# EAGLE design femtoBeacon_dongle_r2.0.3 (EAGLE 7.6.0)
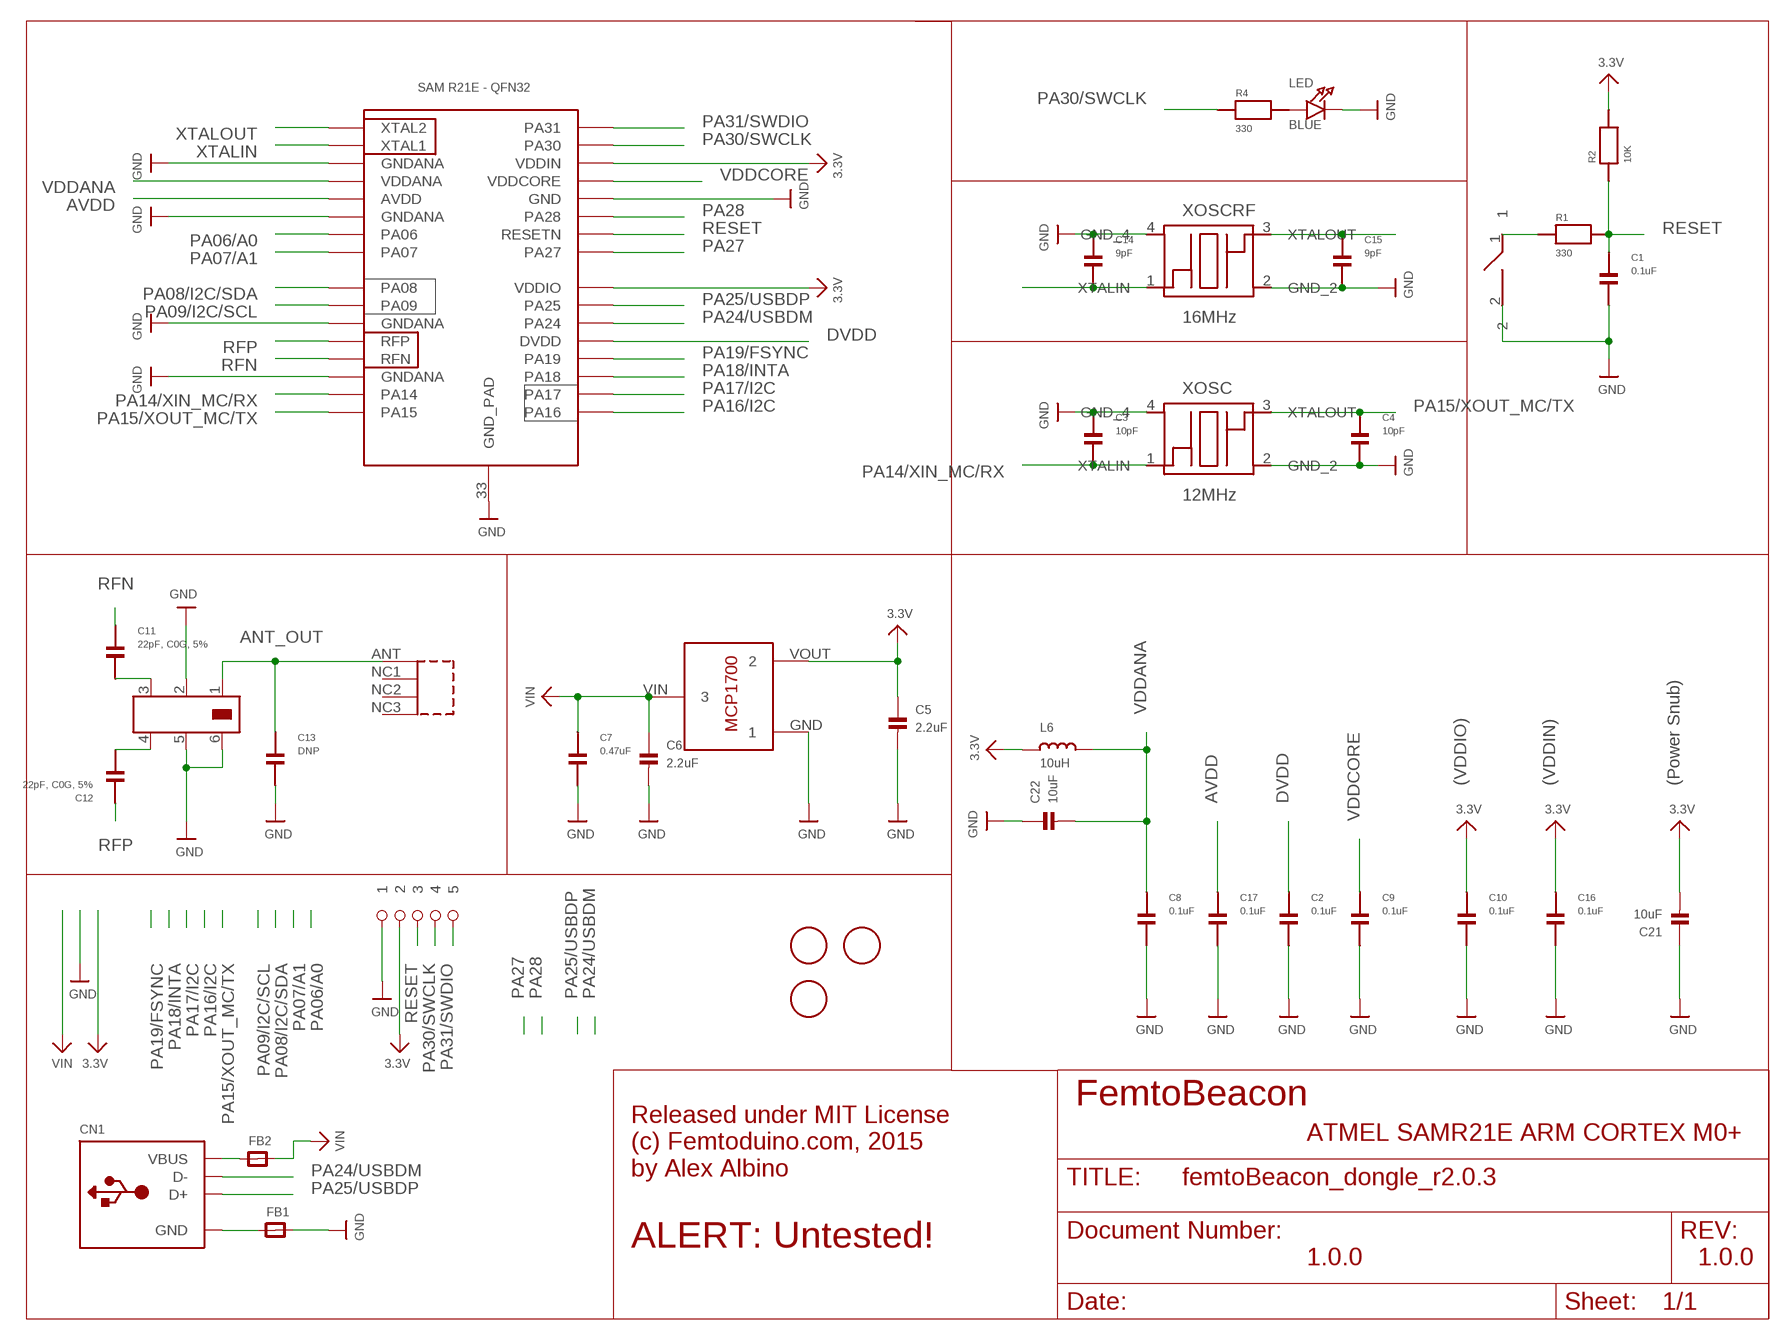
[diagram p0: schematic, sheet 1]

## Parts
BTN  DNP  SPST_SMD  [SPST_SMD]
C1  0.1uF  CAPACITOR_0201  [PART]
C2  0.1uF  CAPACITOR_0201  [PART]
C3  10pF  CAPACITOR_0201  [PART]
C4  10pF  CAPACITOR_0201  [PART]
C5  2.2uF  CAP_CERAMIC_0402MP  [_0402MP]
C6  2.2uF  CAP_CERAMIC_0402MP  [_0402MP]
C7  0.47uF  CAPACITOR_0201  [PART]
C8  0.1uF  CAPACITOR_0201  [PART]
C9  0.1uF  CAPACITOR_0201  [PART]
C10  0.1uF  CAPACITOR_0201  [PART]
C11  22pF, C0G, 5%  CAPACITOR_0201  [PART]
C12  22pF, C0G, 5%  CAPACITOR_0201  [PART]
C13  DNP  CAPACITOR_0201  [PART]
C14  9pF  CAPACITOR_0201  [PART]
C15  9pF  CAPACITOR_0201  [PART]
C16  0.1uF  CAPACITOR_0201  [PART]
C17  0.1uF  CAPACITOR_0201  [PART]
C21  10uF  CAP_CERAMIC_0402MP  [_0402MP]
C22  10uF  CAP_CERAMIC_0402MP  [_0402MP]
CN1  USB_TYPEA  [USB_A-SMT]
FB1  FERRITE_0603MP  [_0603MP]
FB2  FERRITE_0603MP  [_0603MP]
FID1  FIDUCIAL  [FIDUCIAL_1MM]
FID2  FIDUCIAL  [FIDUCIAL_1MM]
FID3  FIDUCIAL  [FIDUCIAL_1MM]
L6  10uH  INDUCTOR_0603MP  [_0603MP]
LDO_VREG  MCP1700T-3302E/TT  [MCP1700T-3302E/TT]
LED  BLUE  LED0603_NOOUTLINE  [CHIPLED_0603_NOOUTLINE]
R1  330  RESISTOR_0201  [PART]
R2  10K  RESISTOR_0201  [PART]
R4  330  RESISTOR_0201  [PART]
U$1  1X5_ROUND  [1X5_ROUND]
U$6  0479480001  [0479480001]
U$12  JOHANSON_2450BM15A0015E  [0805_BALUN]
U$76  ATSAMR21E18A-MUT  [QFN32]
XOSC  12MHz  TSX-3225  [TSX-3225]
XOSCRF  16MHz  TSX-3225  [TSX-3225]

## Nets
3.3V: C5.1 C10.1 C16.1 C21.2 L6.1 LDO_VREG.VOUT R2.2 U$1.P$2 U$76.24(VDDIO) U$76.30(VDDIN)
ANT_OUT: C13.1 U$6.ANT U$12.1
AVDD: C17.1 U$76.5(AVDD)
DVDD: C2.1 U$76.21(DVDD)
GND: BTN.2 C1.2 C2.2 C3.1 C4.2 C5.2 C6.2 C7.2 C8.2 C9.2 C10.2 C13.2 C14.1 C15.2 C16.2 C17.2 C21.1 C22.1 FB1.2 LDO_VREG.GND LED.C U$1.P$1 U$12.2 U$12.5 U$12.6 U$76.3(GNDANA) U$76.6(GNDANA) U$76.11(GNDANA) U$76.14(GNDANA) U$76.28(GND) U$76.33(GND_PAD) XOSC.2(GND_2) XOSC.4(GND_4) XOSCRF.2(GND_2) XOSCRF.4(GND_4)
N$1: C11.2 U$12.3
N$3: C12.2 U$12.4
N$4: CN1.VBUS FB2.1
N$5: CN1.GND FB1.1
N$13: LED.A R4.2
N$26: BTN.1 R1.1
PA06/A0: U$76.7(PA06)
PA07/A1: U$76.8(PA07)
PA08/I2C/SDA: U$76.9(PA08)
PA09/I2C/SCL: U$76.10(PA09)
PA14/XIN_MC/RX: C3.2 U$76.15(PA14) XOSC.1(XTALIN)
PA15/XOUT_MC/TX: C4.1 U$76.16(PA15) XOSC.3(XTALOUT)
PA16/I2C: U$76.17(PA16)
PA17/I2C: U$76.18(PA17)
PA18/INTA: U$76.19(PA18)
PA19/FSYNC: U$76.20(PA19)
PA24/USBDM: CN1.D- U$76.22(PA24)
PA25/USBDP: CN1.D+ U$76.23(PA25)
PA27: U$76.25(PA27)
PA28: U$76.27(PA28)
PA30/SWCLK: R4.1 U$1.P$4 U$76.31(PA30)
PA31/SWDIO: U$1.P$5 U$76.32(PA31)
RESET: C1.1 R1.2 R2.1 U$1.P$3 U$76.26(RESETN)
RFN: C11.1 U$76.13(RFN)
RFP: C12.1 U$76.12(RFP)
VDDANA: C8.1 C22.2 L6.2 U$76.4(VDDANA)
VDDCORE: C9.1 U$76.29(VDDCORE)
VIN: C6.1 C7.1 FB2.2 LDO_VREG.VIN
XTALIN: C14.2 U$76.2(XTAL1) XOSCRF.1(XTALIN)
XTALOUT: C15.1 U$76.1(XTAL2) XOSCRF.3(XTALOUT)
Unconnected: U$6.NC1 U$6.NC2 U$6.NC3

## Notes on the sheet
- (VDDIO) | (VDDIN) | (Power Snub)
- FemtoBeacon
- ATMEL SAMR21E ARM CORTEX M0+
- Released under MIT License
  (c) Femtoduino.com, 2015
  by Alex Albino
- ALERT: Untested!
- 1.0.0 | 1.0.0

## Library data of the parts
BTN = femtoduino:SPST_SMD
C1 C3 C4 C8-C17 = parts_0201:CAPACITOR_0201; DIGIKEY_PART: 490-3194-1-ND
C2 C7 = parts_0201:CAPACITOR_0201
C5 C6 C21 C22 = microbuilder:CAP_CERAMIC: Ceramic Capacitors 0402 - 0402 Surface Mount Capacitors 16pF 50V 5% [Digikey: 445-4899-2-ND] 18pF 50V 5% [Digikey: 490-1281-2-ND] 22pF 50V 5% [Digikey: 490-1283-2-ND] 68pF 50V 5% [Digikey: 490-1289-2-ND] 0.1uF 10V 10% [Digikey: 490-1318-2-ND] 1.0uF 6.3V 10% [Digikey: 490-1320-2-ND] 0603 - 0603 Surface Mount Capacitors 16 pF 50V 5% [Digikey: 445-5051-2-ND] 22 pF 50V [Digikey: PCC220ACVTR-ND] 33 pF 50V 5% [Digikey: 490-1415-1-ND] 56pF 50V 5% [Digikey: 490-1421-1-ND] 220pF 50V 5% [Digikey: 445-1285-1-ND] 680 pF 50V 2200 pF 50V 5% C0G [Digikey: 445-1297-1-ND] 5600 pF 100V 5% X7R [Digikey: 478-3711-1-ND] 0.1 µF 25V 10% [Digikey: PCC2277TR-ND] 0.22 µF 16V 10% X7R [Digikey: 445-1318-1-ND] 1.0 µF 25V 10% [Digikey: 445-5146-2-ND] 0603 - RF Specific 3pF 250V +/-0.1pF RF [Digikey: 712-1347-1-ND] 18 pF 250V 5% [Digikey: 478-3505-1-ND or 712-1322-1-ND] 56 pF 250V 5% C0G RF [Digikey: 490-4867-1-ND] 68 pF 250V RF [Digikey: 490-4868-1-ND] 0805 - 0805 Surface Mount Capacitors 220 pF 250V 2% RF Ceramic Capacitor [Digikey: 712-1398-1-ND] 1000 pF 50V 2% NP0 Ceramic Capacitor [Digikey: 478-3760-1-ND] 0.1 µF 25V 10% Ceramic Capacitor [Digikey: PCC1828TR-ND] 1.0 µF 16V 10% Ceramic Capacitor[Digikey: 490-1691-2-ND] 10.0 µF 10V 10% Ceramic Capacitor[Digikey: 709-1228-1-ND] 10.0 uF 16V 10% Ceramic Capacitor [Digikey: 478-5165-2-ND] 47 uF 6.3V 20% Ceramic Capacitor [Digikey: 587-1779-1-ND or 399-5506-1-ND] 1206 - 1206 Surface Mount Capacitors 47uF 10V 20% Ceramic Capacitor [Digikey: 490-5528-1-ND or 399-5508-1-ND or 445-6010-1-ND] 100uF 6.3V -20%, +80% Y5V Ceramic Capacitor (Digikey: 490-4512-1-ND, Mouser: 81-GRM31CF50J107ZE1L)
CN1 = microbuilder:USB_TYPEA: USB - Type A Connectors Male types stick out and are inserted into a PC or matching females parts (these are the connectors used on USB Memory Sticks, etc.). Female parts are generally used for USB Host and accept a male-type connector. SMT Male - 4UCON: 10017 PTH Female - Digikey: 609-1045-ND, 4UCon: 05241
FB1 FB2 = microbuilder:FERRITE: Ferrite Bead 0603 MMZ1608B121C - 120 Ohm @ 100MHz, 600mA, 0.15 Ohm DC Resistance - Digikey: 445-2164-1-ND BK1608HW121-T - 120 Ohm, 600mA Ferrite Chip - Digikey: 587-1876-2-ND 0805 HZ0805B272R-10 - 2.7K Ohm @ 100MHz, 200mA, 0.8 Ohm DC Resistance - Digikey: 240-2504-1-ND (see also Murata BLM21BD272SN1L) MMZ2012Y152B - 1.5K Ohm @ 100MHz, 500mA, 0.4 Ohm DC Resistance - Digikey: 445-1560-1-ND - Mainly for high frequency (80-400MHz) MMZ2012R102A - 1K Ohm @ 100MHz, 500mA, 0.3 Ohm DC Resistance - Digikey: 445-1555-2-ND - More general purpose (10-200MHz)
FID1-FID3 = adafruit:FIDUCIAL: For use by pick and place machines to calibrate the vision/machine, 1mm By microbuilder.eu
L6 = microbuilder:INDUCTOR: Inductors 0603: 10nH Ceramic Inductor - microwire antenna/RF (Digikey: 712-1434-2-ND) 0805: 560nH Ceramic Inductor - RF (Digikey: 553-1047-1-ND) 270nH Ceramic Inductor - Q = 40@250MHz, +-5%, 1 Ohm DC Resistance (Digikey: 535-10506-2-ND) 1007 (2518 Metric) SMT: 10µH 10% 250mOhm 820mA 1007 Inductor (Digikey: 587-2189-1-ND) 22µH 10% 500mOhm 580mA 1007 Inductor (Digikey: 587-2190-1-ND) 47µH 10% 950mOhm 420mA 1007 Inductor (Digikey: 587-2191-1-ND) 47µH 5% 100mOhm 1A 1008 Inductor (Digikey: 732-1816-1-ND) 5.0x5.0mm (Taiyo Yuden NR5040 Series) 6.8µH 20% 2.3A 64mOhm Inductor (Digikey: 587-2374-2-ND) 5.0x5.0mm (TDK VLC5045 Series) 4.7µH 20% 3.3A 34mOhm Inductor (Digikey: 445-6526-1-ND) 6.8µH 20% 2.7A 46mOhm Inductor (Digikey: 445-6527-1-ND) 6.0x6.0mm (TDK VLC6045 Series) 4.7µH 20% 3.8A 27mOhm Inductor (Digikey: 445-6538-2-ND) 6.8µH 20% 3A 41mOhm Inductor (Digikey: 445-6540-1-ND) 6.2µH 30% 2.2A 45mOhm Inductor (Digikey: SRR5028-6R2YCT-ND) - Not TDK VLC6045 but footprint should match 6.0x6.0mm (TDK SLF6045 Series) 6.8uH 30% 2A 33mOhm Inductor (Digikey: 445-4572-1-ND, Mouser: 810-SLF645T6R8N2R0PF)
LDO_VREG = MCP1700T-3302E_TT:MCP1700T-3302E/TT: Microchip LDO "MCP1700" in a 3-Pin SOT-23 package. ID: MCP1700T-3302E/TT
LED = microbuilder:LED: LED 0603 - 0603 Surface Mount Package 2mA: Green LED - Low Power (3.9mcd, 2ma, 1.7Vf) - Digikey: 475-2709-2-ND Orange LED - Low Power (9.8mcd, 2ma, 1.8Vf) - Digikey: 475-1194-2-ND Red LED - Low Power (5mcd, 2ma, 1.8Vf) - Digikey: 475-1195-2-ND Yellow LED - Low Power (7mcd, 2ma, 1.8Vf) - Digikey: 475-1196-2-ND 5mA: Blue LED - Low Power (17mcd, 5ma, 2.9Vf) - Digikey: LNJ937W8CRACT-ND 0805 - 0805 Surface Mount Package 2mA: Red LED (8.8mcd, 2mA, 1.8Vf, Clear) - Low Power [Digikey: 475-2510-1-ND] Green LED (5mcd, 2mA, 1.8Vf, Clear) - Low Power [Digikey: 475-2730-1-ND] Yellow LED (11.3mcd, 2mA, 1.8Vf, Clear) - Low Power [Digikey: 475-2555-1-ND] 20mA: Red LED (104mcd, 20mA, Diffused) - LS R976 [Digikey: 475-1278-6-ND] Red LED (12mcd, 20mA, 2.0Vf, Clear) - APT2012EC [Digikey: 754-1128-1-ND] Green LED (15mcd, 20mA, 2.2Vf, Clear) - APT2012GC [Digikey: 754-1131-1-ND] Orange LED (160mcd, 20mA, 2.1Vf, Clear) - APT2012SECK [Digikey: 754-1130-1-ND] 1206 - 1206 Surface Mount Package Green LED (26mcd, 20mA, Diffused) - LG N971 [Digikey: 475-1407-6-ND] Red LED (15mcd, 20mA, Diffused) - LH N974 [Digikey: 475-1416-6-ND]
R1 R2 R4 = parts_0201:RESISTOR_0201
U$1 = pins_fine_pitch:1X5_ROUND
U$6 = molex-antenna-2.4GHz:0479480001
U$12 = balun:JOHANSON_2450BM15A0015E
U$76 = atmel-samr21:ATSAMR21E18A-MUT: This is the ATMEL SAMR21E QFN-32. ATSAMR21E18A
XOSC XOSCRF = crystals:TSX-3225

## Board
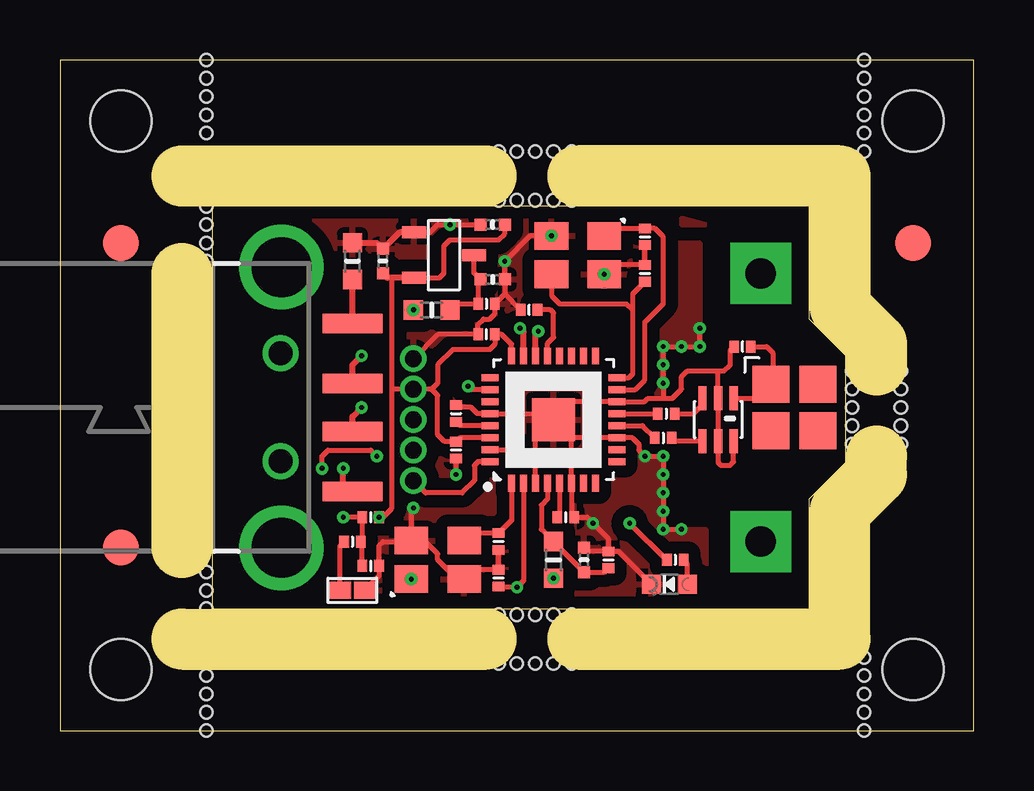
[diagram p1: board, top side]
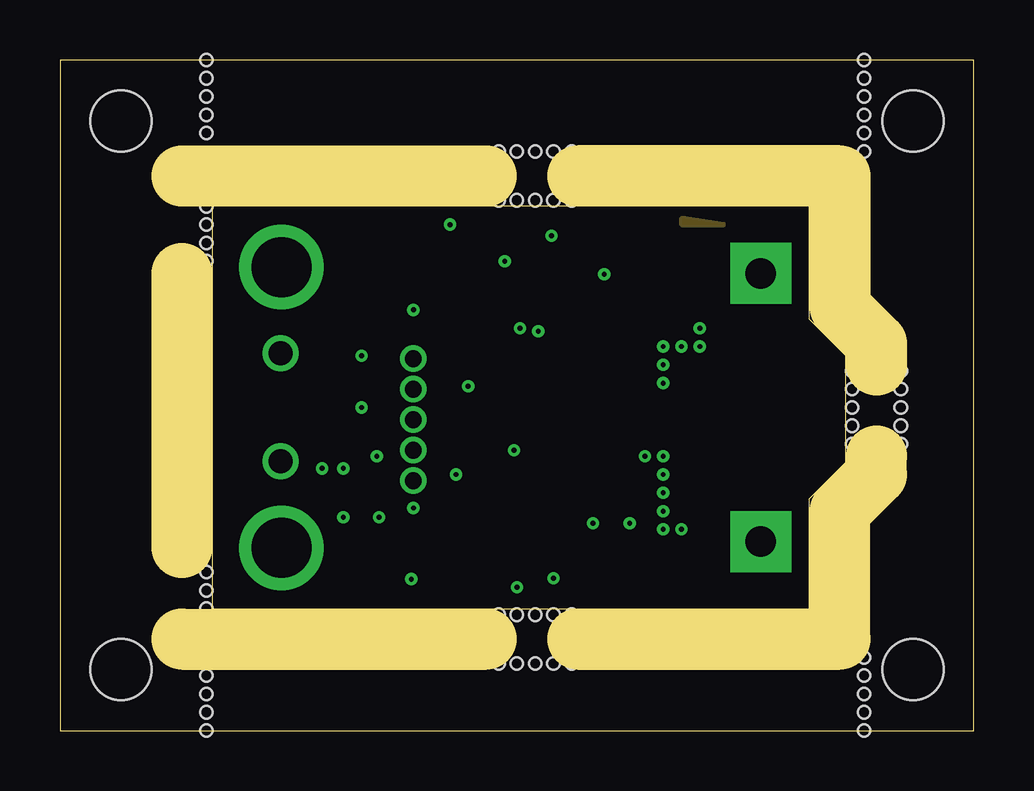
[diagram p2: board, inner layer Route2]
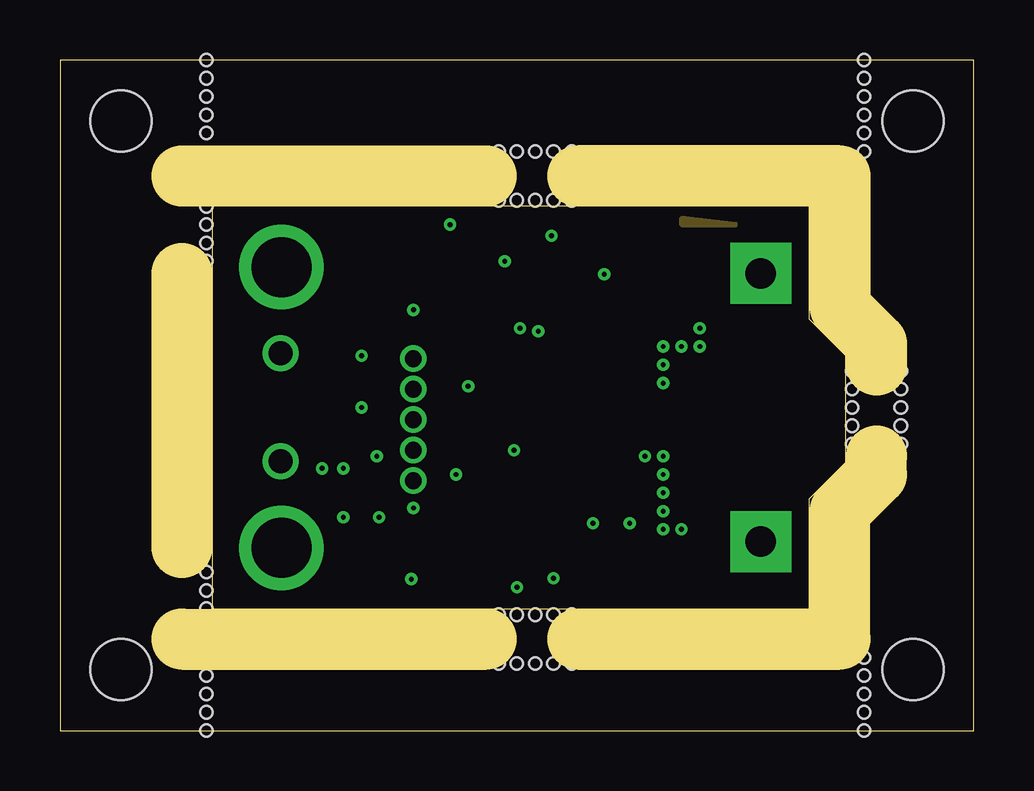
[diagram p3: board, inner layer Route15]
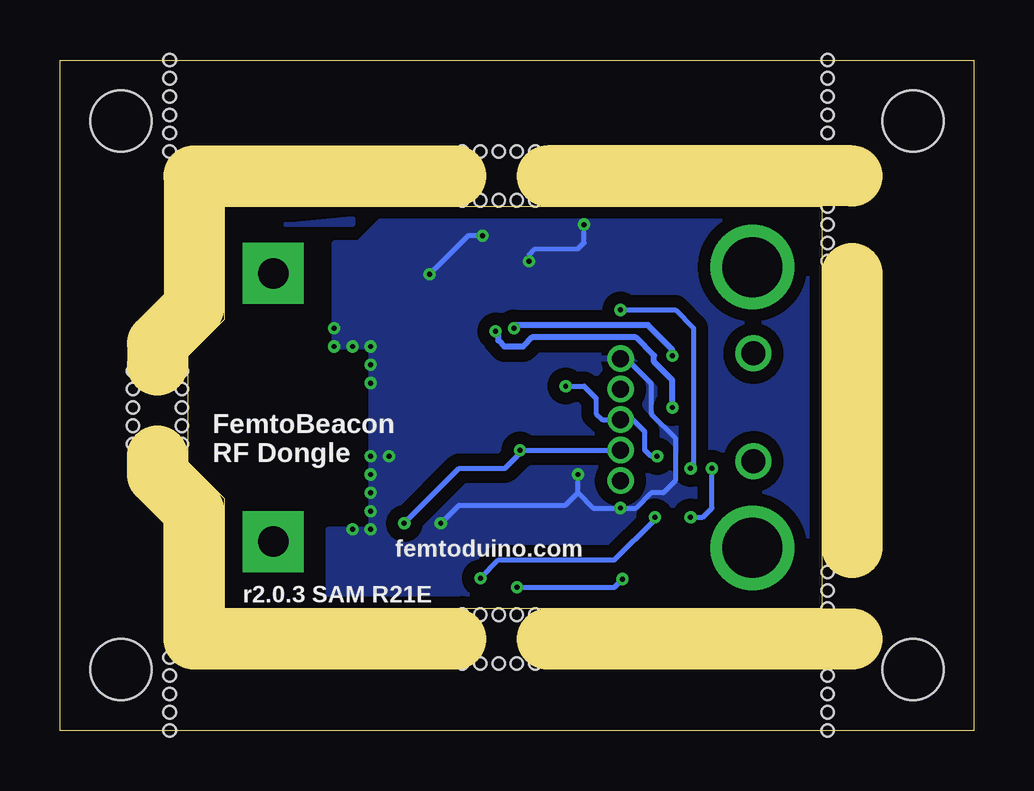
[diagram p4: board, bottom side, seen from below]

Size 38.1 x 27.94 mm. Coordinates in mm from the lower left corner, seen from the top.
Outline: 6.35,5.08 31.24,5.08 31.24,9.65 32.77,11.18 32.77,15.62 31.24,17.14 31.24,21.84 6.35,21.84 6.35,5.08
Outline: 0,0 38.1,0 38.1,27.94 0,27.94 0,0
Copper layers (1+2*15+16): Top 0.035mm / dielectric 1.5mm / Route2 0.035mm / dielectric 0.15mm / Route15 0.035mm / dielectric 0.2mm / Bottom 0.035mm
Design rules "femtoduino_5mil_4layer": minimum track width 5mil, minimum drill 5mil, track to track 5mil, track to pad 5mil, pad to pad 5mil, via to via 5mil, smd to smd 5mil, copper to edge 5mil, drill to drill 5mil, minimum pad ring 8mil, minimum via ring 5mil, stop-mask expansion 2mil, vias tented up to drill 30mil, thermal gap 10mil
Holes 2.54 mm at 2.54,2.54 2.54,25.4 35.56,25.4 35.56,2.54
Holes 0.51 mm at 6.1,21.84 6.1,21.08 6.1,20.32 6.1,19.56 6.1,5.08 6.1,5.84 6.1,6.6 19.81,4.83 19.05,4.83 18.29,4.83 20.57,4.83 21.34,4.83 33.02,13.46 33.02,14.22 33.02,14.99 33.02,12.7 33.02,11.94 35.05,13.46 35.05,14.22 35.05,12.7 35.05,11.94 35.05,14.99 19.81,2.79 19.05,2.79 18.29,2.79 20.57,2.79 21.34,2.79 19.81,22.1 19.05,22.1 18.29,22.1 20.57,22.1 21.34,22.1 19.81,24.13 19.05,24.13 18.29,24.13 20.57,24.13 21.34,24.13 33.53,24.13 33.53,24.89 33.53,25.65 33.53,26.42 33.53,27.18 33.53,27.94 33.53,3.05 33.53,0 33.53,0.76 33.53,1.52 33.53,2.29 6.1,24.89 6.1,25.65 6.1,26.42 6.1,27.18 6.1,27.94 6.1,0 6.1,0.76 6.1,1.52 6.1,2.29
Milling: 11 lines

### Footprints (pad centres in the part's own frame; a part is rotated, then mirrored left to right if it is on the bottom)
SPST_SMD = smd 0.889 x 0.699: 1 -0.508,0; 2 0.508,0
PART = smd 0.4 x 0.5: 1 -0.35,0; 2 0.35,0
_0402MP = smd 0.5 x 0.5: 1 -0.508,0; 2 0.508,0
USB_A-SMT = drill 2.5 pad 3.302: D1 -5.85,2.958; D2 5.85,2.958 | drill 1: D3 -2.25,3; D4 2.25,3 | smd 0.8 x 2.5: D+ 1,0; D- -1,0; GND 3.5,0; VBUS -3.5,0
_0603MP = smd 0.8 x 0.8: 1 -0.762,0; 2 0.762,0
FIDUCIAL_1MM = smd 1.5 x 1.5: 1 0,0
MCP1700T-3302E/TT = smd 0.5 x 1: GND -0.95,-1.25; VIN 0,1.25; VOUT 0.95,-1.25
CHIPLED_0603_NOOUTLINE = smd 0.8 x 0.8: A 0,-0.75; C 0,0.75
1X5_ROUND = drill 0.7 pad 1: P$1 0,0; P$2 0,-1.27; P$3 0,-2.54; P$4 0,-3.81; P$5 0,-5.08
0479480001 = smd 1.54 x 1.54: ANT -0.963,0.963; NC1 0.978,0.963; NC2 0.978,-0.978; NC3 -0.963,-0.978
0805_BALUN = smd 1 x 0.35: 1 -0.9,0.65; 2 -0.9,0; 3 -0.9,-0.65; 4 0.9,-0.65; 5 0.9,0; 6 0.9,0.65
QFN32 = smd 0.7 x 0.3: 1 -2.65,1.75; 2 -2.65,1.25; 3 -2.65,0.75; 4 -2.65,0.25; 5 -2.65,-0.25; 6 -2.65,-0.75; 7 -2.65,-1.25; 8 -2.65,-1.75; 17 2.65,-1.75; 18 2.65,-1.25; 19 2.65,-0.75; 20 2.65,-0.25; 21 2.65,0.25; 22 2.65,0.75; 23 2.65,1.25; 24 2.65,1.75 | smd 0.3 x 0.7: 9 -1.75,-2.65; 10 -1.25,-2.65; 11 -0.75,-2.65; 12 -0.25,-2.65; 13 0.25,-2.65; 14 0.75,-2.65; 15 1.25,-2.65; 16 1.75,-2.65; 25 1.75,2.65; 26 1.25,2.65; 27 0.75,2.65; 28 0.25,2.65; 29 -0.25,2.65; 30 -0.75,2.65; 31 -1.25,2.65; 32 -1.75,2.65 | smd 1.8 x 1.8: 33 0,0
TSX-3225 = smd 1.4 x 1.15: 1 -1.1,-0.8; 2 1.1,-0.8; 3 1.1,0.8; 4 -1.1,0.8

### Placement (x,y rotation side)
BTN  12.19,5.84 0 top
C1  12.95,6.86 0 top
C2  19.56,17.53 180 top
C3  24.38,20.57 90 top
C4  24.38,19.05 90 top
C5  18.03,21.08 180 top
C6  18.03,18.8 0 top
C7  17.78,17.78 0 top
C8  22.86,7.11 90 top
C9  16.51,13.21 90 top
C10  17.78,16.51 180 top
C11  25.27,13.21 0 top
C12  25.15,12.19 0 top
C13  28.45,16 180 top
C14  18.29,6.35 270 top
C15  18.29,7.87 270 top
C16  16.51,11.68 270 top
C17  21.08,8.89 0 top
C21  13.46,19.56 270 top
C22  21.84,7.11 270 top
CN1  12.19,13.46 90 top
FB1  12.19,19.56 90 top
FB2  15.49,17.53 0 top
FID1  2.54,7.62 0 top
FID2  2.54,20.32 0 top
FID3  35.56,20.32 0 top
L6  20.57,7.11 90 top
LDO_VREG  16,19.81 270 top
LED  25.4,6.1 90 top
R1  12.19,7.87 0 top
R2  12.95,8.89 0 top
R4  25.65,7.11 0 top
U$1  14.73,15.49 0 top
U$6  30.61,13.46 0 top
U$12  27.43,12.95 270 top
U$76  20.57,12.95 90 top
XOSC  21.59,19.81 180 top
XOSCRF  15.75,7.11 0 top

### Tracks (layer width: path | path; a pad name or v marks a point on that pad's centre or on a via)
3.3V  (via drill 0.2 pad 0.51)
  Top 0.203: LDO_VREG.VOUT 15.81,18.86 16,19.05 16,20.19 16.26,20.45 18.29,20.45 18.54,20.7 C5.1 | U$76.24 18.82,16.1 18.41,16.51 C10.1 18.13,16.1 17.91,15.88 16.38,15.88 15.75,15.24 15.75,14.48 15.49,14.22 | 13.84,14.22 13.84,18.86 | 15.49,14.22 U$1.P$2 | U$76.30 16.68,12.2 C16.1 16.03,12.03 15.75,12.32 15.75,13.97 15.49,14.22 | R2.2 13.46,8.89 13.84,9.27 13.84,14.22 | 14.61,14.22 U$1.P$2 | U$1.P$2 13.84,14.22
  Top 0.254: LDO_VREG.VOUT 13.84,18.86 13.65,18.86 C21.2
  Bottom 0.203: L6.1 19.81,7.11 14.99,7.11 13.3,8.79 R2.2
  other vias: 20.57,6.35 13.3,8.89
ANT_OUT
  Top 0.203: C13.1 29.46,16 29.72,15.75 29.72,14.5 U$6.ANT 29.07,13.85 U$12.1
AVDD
  Top 0.203: U$76.5 20.82,8.98 C17.1
DVDD
  Top 0.203: U$76.21 20.32,16.13 20.57,16.38 20.57,17.4 20.45,17.53 C2.1
GND  (via drill 0.2 pad 0.51)
  Top 0.203: LDO_VREG.GND 15.43,20.76 15.75,21.08 v16.26,21.08 C5.2 | XOSC.2 19.6,20.61 v18.54,19.56 C6.2 18.54,18.19 | XOSC.4 23.08,19.4 C4.2 C3.1 | U$76.33 21.32,13.7 U$76.14 24.37,13.7 24.51,13.84 25.15,13.84 | 25.15,13.84 25.53,13.84 25.91,14.22 25.91,14.73 26.16,14.99 27.43,14.99 | 27.43,14.99 27.69,14.99 27.94,15.24 27.94,15.84 C13.2 | 27.43,14.99 U$12.2 U$12.5 27.43,11.18 27.56,11.05 27.94,11.05 28.08,11.19 U$12.6 | BTN.2 13.3,6.45 C1.2 13.3,7.72 13.46,7.87 14.61,7.87 XOSCRF.4 | XOSCRF.4 15.2,7.91 15.75,7.37 15.75,7.11 16.55,6.31 XOSCRF.2 17.24,6.7 C14.1 C15.2 | 21.32,12.2 U$76.6 21.32,9 C17.2 21.97,8.89 v22.23,8.64 22.86,8 C8.2 | U$76.33 20.32,13.2 U$76.28 17.4,13.2 17.14,13.46 16.61,13.46 C9.2 | 18.54,18.19 C7.2 18.13,17.37 17.91,17.14 17.65,17.14 17.43,16.92 C10.2 15.75,16.51 U$1.P$1 | C16.2 v16.51,10.67 | XOSCRF.4 14.65,9.19 v14.73,9.27 | U$76.3 19.82,12.2 U$76.33 | C8.2 22,7.46 C22.1 | C8.2 23.28,7.46 LED.C | C2.2 18.54,18.19 | v26.67,16.76 v26.67,16 v25.91,16 v25.15,16 v25.15,15.24 v25.15,14.48 25.15,13.84 | v25.91,8.38 v25.15,8.38 v25.15,9.14 v25.15,9.91 v25.15,10.67 v25.15,11.43 v24.38,11.43 24.13,11.68 24.13,11.94 23.86,12.2 U$76.11 21.32,12.2 | 21.32,12.2 U$76.33
  Top 0.254: FB1.2 13.21,20.32 C21.1 14.16,20.76 LDO_VREG.GND
  Bottom 0.203: v18.54,19.56 18.54,19.81 18.29,20.07 16.51,20.07 16.26,20.32 v16.26,21.08 | XOSC.2 21.09,20.61 XOSC.4 | v22.23,8.64 21.46,9.4 17.02,9.4 16.51,9.91 | 16.51,9.91 v16.51,10.67 | 16.51,9.91 15.88,9.27 v14.73,9.27 14.1,9.27 13.46,9.91 12.95,9.91 12.45,10.41 12.45,12.19 13.46,13.21 13.46,14.48 14.48,15.49 U$1.P$1
  other vias: 20.49,20.61 22.69,19.01
  pour Bottom (isolate 0.508): 6.6,21.59 24.38,21.59 25.65,20.32 26.67,20.32 26.67,16 25.15,16 25.15,8.38 26.92,8.38 26.92,5.33 6.6,5.33
  pour Top (isolate 0.508): 6.6,21.59 24.38,21.59 25.65,20.32 26.67,20.32 26.67,16 25.15,16 25.15,8.38 26.92,8.38 26.92,5.33 6.6,5.33
MOUNT1  (via drill 1.27 pad 2.54)
  other vias: 29.21,19.05
MOUNT2  (via drill 1.27 pad 2.54)
  other vias: 29.21,7.87
N$1
  Top 0.203: C11.2 26.42,13.21 26.78,13.57 U$12.3
N$3
  Top 0.203: U$12.4 25.63,12.05 C12.2
N$4  (via drill 0.2 pad 0.51)
  Top 0.254: CN1.VBUS 11.81,9.96 v11.81,10.92
  Bottom 0.203: FB2.1 12.45,17.53 11.68,16.76 11.68,11.05 v11.81,10.92
  other vias: 14.73,17.53
N$5
  Top 0.254: CN1.GND FB1.1
N$6
  pour Top: 25.91,21.34 25.91,21.08 26.92,21.08
N$7
  pour Route2: 25.91,21.34 25.91,21.08 27.69,21.08
N$8
  pour Route15: 25.91,21.34 25.91,21.08 28.19,21.08
N$9
  pour Bottom: 25.91,21.34 25.91,21.08 28.7,21.08
N$13
  Top 0.203: LED.A 26.15,6.97 R4.2
N$26
  Top 0.203: BTN.1 11.68,7.72 R1.1
PA14/XIN_MC/RX
  Top 0.203: U$76.15 23.98,14.2 24.38,14.61 24.38,17.02 25.15,17.78 25.15,20.57 24.8,20.92 C3.2 23,20.92 XOSC.1
PA15/XOUT_MC/TX
  Top 0.203: U$76.16 23.72,14.7 23.88,14.86 23.88,17.53 | 23.88,17.53 23.88,18.19 C4.1 | XOSC.3 20.49,18.12 20.83,17.78 23.62,17.78 23.88,17.53
PA24/USBDM  (via drill 0.2 pad 0.51)
  Top 0.254: U$76.22 19.82,16.52 v19.94,16.64 | CN1.D- 12.19,13.08 v12.57,13.46
  Bottom 0.254: v12.57,13.46 12.57,14.61 13.34,15.37 13.34,15.62 14.1,16.38 18.41,16.38 18.8,16 19.57,16 19.82,16.26 19.82,16.52 v19.94,16.64
PA25/USBDP  (via drill 0.2 pad 0.51)
  Top 0.254: CN1.D+ 12.19,15.24 v12.57,15.62 | U$76.23 19.32,16.62 v19.18,16.76
  Bottom 0.254: v12.57,15.62 12.57,15.88 13.59,16.89 19.05,16.89 v19.18,16.76
PA30/SWCLK  (via drill 0.2 pad 0.51)
  Top 0.203: U$76.31 18.9,11.7 v18.92,11.68 | v23.75,8.64 25.27,7.11 R4.1
  Bottom 0.203: U$1.P$4 v18.92,11.68 18.92,11.56 19.56,10.92 21.46,10.92 v23.75,8.64
PA31/SWDIO
  Top 0.203: U$76.32 17.43,11.2 17.27,11.05 17.27,10.41 16.76,9.91 15.24,9.91 U$1.P$5
RESET  (via drill 0.2 pad 0.51)
  Top 0.203: C1.1 12.6,7.81 R1.2 12.6,7.94 R2.1 v11.81,8.89 | U$76.26 17.16,14.2 v17.02,14.35 | v10.92,10.92 10.92,11.43 11.18,11.68 12.95,11.68 v13.21,11.43
  Bottom 0.203: v17.02,14.35 16.26,14.35 15.75,13.84 15.75,13.21 15.49,12.95 U$1.P$3 14.22,12.95 13.72,12.45 13.72,11.68 13.46,11.43 v13.21,11.43 | v10.92,10.92 10.92,9.27 11.3,8.89 v11.81,8.89
RFN
  Top 0.203: U$76.13 24.79,13.2 C11.1
RFP
  Top 0.203: U$76.12 24.28,12.7 C12.1
VDDANA
  Top 0.203: U$76.4 20.32,9.66 20.07,9.4 20.07,8.38 L6.2 C22.2 22.7,6.6 C8.1
VDDCORE
  Top 0.203: U$76.29 16.66,12.7 C9.1
VIN
  Top 0.203: FB2.2 16.51,17.78 C7.1 17.43,18.7 C6.1 17.25,19.07 LDO_VREG.VIN
XTALIN  (via drill 0.2 pad 0.51)
  Top 0.203: C14.2 19.02,6 v19.05,5.97 19.32,6.24 U$76.2
  Bottom 0.203: v19.05,5.97 14.99,5.97 XOSCRF.1
  other vias: 14.65,6.31
XTALOUT
  Top 0.203: XOSCRF.3 17.16,8.22 C15.1 18.82,8.76 U$76.1

### Text on the board
bNames: FemtoBeacon / RF Dongle | femtoduino.com | r2.0.3 SAM R21E